# EAGLE design brainslug_board_1 (EAGLE 6.3)
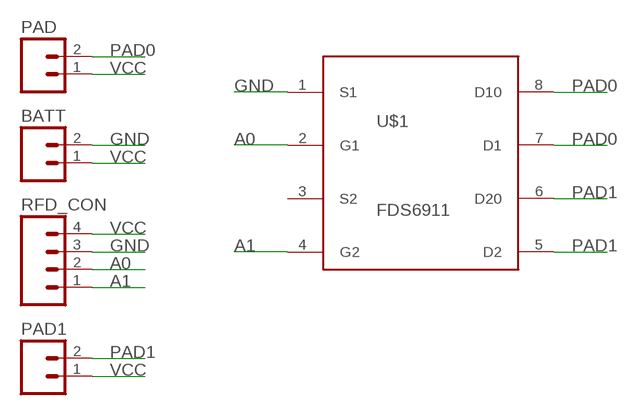
[diagram p0: schematic, sheet 1]

## Parts
BATT  M02PTH  [1X02]
PAD  M02PTH  [1X02]
PAD1  M02PTH  [1X02]
RFD_CON  M04PTH  [1X04]
U$1  FDS6911  [SO8]

## Nets
A0: RFD_CON.2 U$1.2(G1)
A1: RFD_CON.1 U$1.4(G2)
GND: BATT.2 RFD_CON.3 U$1.1(S1)
PAD0: PAD.2 U$1.7(D1) U$1.8(D10)
PAD1: PAD1.2 U$1.5(D2) U$1.6(D20)
VCC: BATT.1 PAD1.1 PAD.1 RFD_CON.4
Unconnected: U$1.3(S2)

## Library data of the parts
BATT PAD PAD1 = SparkFun-Connectors:M02: Header 2 Standard 2-pin 0.1" header. Use with straight break away headers (SKU : PRT-00116), right angle break away headers (PRT-00553), swiss pins (PRT-00743), machine pins (PRT-00117), and female headers (PRT-00115). Molex polarized connector foot print use with SKU : PRT-08233 with associated crimp pins and housings.
RFD_CON = SparkFun-Connectors:M04: Header 4 Standard 4-pin 0.1" header. Use with straight break away headers (SKU : PRT-00116), right angle break away headers (PRT-00553), swiss pins (PRT-00743), machine pins (PRT-00117), and female headers (PRT-00115). Molex polarized connector foot print use with SKU : PRT-08231 with associated crimp pins and housings. 1MM SMD Version SKU: PRT-10208
U$1 = AKA_test:FDS6911: FDS6911 Dual N-Channel Logic Level PowerTrench® MOSFET 20V, 7.5A, 13mΩ

## Board
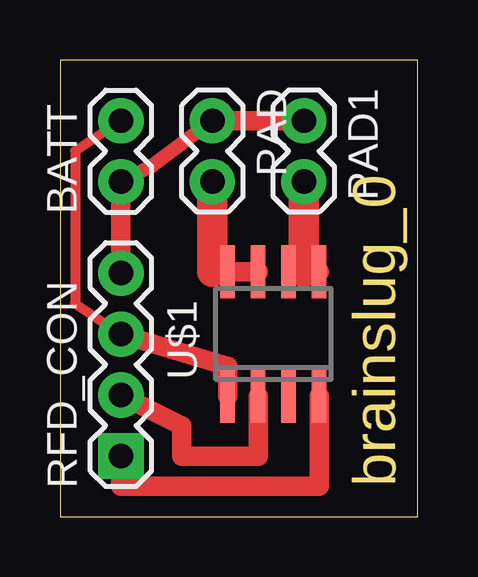
[diagram p1: board, top side]

Size 14.91 x 19.04 mm. Coordinates in mm from the lower left corner, seen from the top.
Outline: 0,0 14.91,0 14.91,19.04 0,19.04 0,0
Copper layers (1*16): Top 0.035mm / dielectric 1.5mm / Bottom 0.035mm
Design rules "default": minimum track width 10mil, minimum drill 24mil, track to track 8mil, track to pad 8mil, pad to pad 8mil, via to via 8mil, smd to smd 8mil, copper to edge 40mil, drill to drill 8mil, minimum pad ring 10mil, minimum via ring 8mil, stop-mask expansion 4mil, vias tented up to drill 0mil, thermal gap 10mil

### Footprints (pad centres in the part's own frame; a part is rotated, then mirrored left to right if it is on the bottom)
1X02 = drill 1.016 pad 1.88: 1 0,0; 2 2.54,0
1X04 = drill 1.016 pad 1.88 square: 1 0,0 | drill 1.016 pad 1.88: 2 2.54,0; 3 5.08,0; 4 7.62,0
SO8 = smd 0.6 x 2.2: 1 -1.905,-2.6; 2 -0.635,-2.6; 3 0.635,-2.6; 4 1.905,-2.6; 5 1.905,2.6; 6 0.635,2.6; 7 -0.635,2.6; 8 -1.905,2.6

### Placement (x,y rotation side)
BATT  2.54,13.97 90 top
PAD  6.35,16.51 270 top
PAD1  10.16,16.51 270 top
RFD_CON  2.54,2.54 90 top
U$1  8.89,7.62 0 top

### Tracks (layer width: path | path; a pad name or v marks a point on that pad's centre or on a via)
A0
  Top 0.813: U$1.2 8.26,2.54 5.08,2.54 5.08,3.81 RFD_CON.2
A1
  Top 0.813: U$1.4 10.79,1.27 2.54,1.27 RFD_CON.1
GND
  Top 0.406: RFD_CON.3 0.64,8.89 0.64,15.24 BATT.2
  Top 0.813: U$1.1 6.99,6.29 RFD_CON.3
PAD0
  Top 0.406: U$1.8 6.35,10.22
  Top 0.813: U$1.7 U$1.8
  Top 1.27: 6.35,10.22 PAD.2
PAD1
  Top 0.406: U$1.6 10.16,10.22
  Top 0.813: U$1.5 10.16,10.22
  Top 1.27: 10.16,10.22 PAD1.2
VCC
  Top 0.61: BATT.1 3.81,14.61 PAD.1
  Top 0.813: PAD1.1 PAD.1 | BATT.1 RFD_CON.4

### Text on the board
Dimension: brainslug_0